# EasyEDA schematic sct.json
TITLE: Sheet_1; REV: 1.0; Date: 2026-02-04; Sheet: 1/1; Drawn By: 20200936pm; Company: Your Company
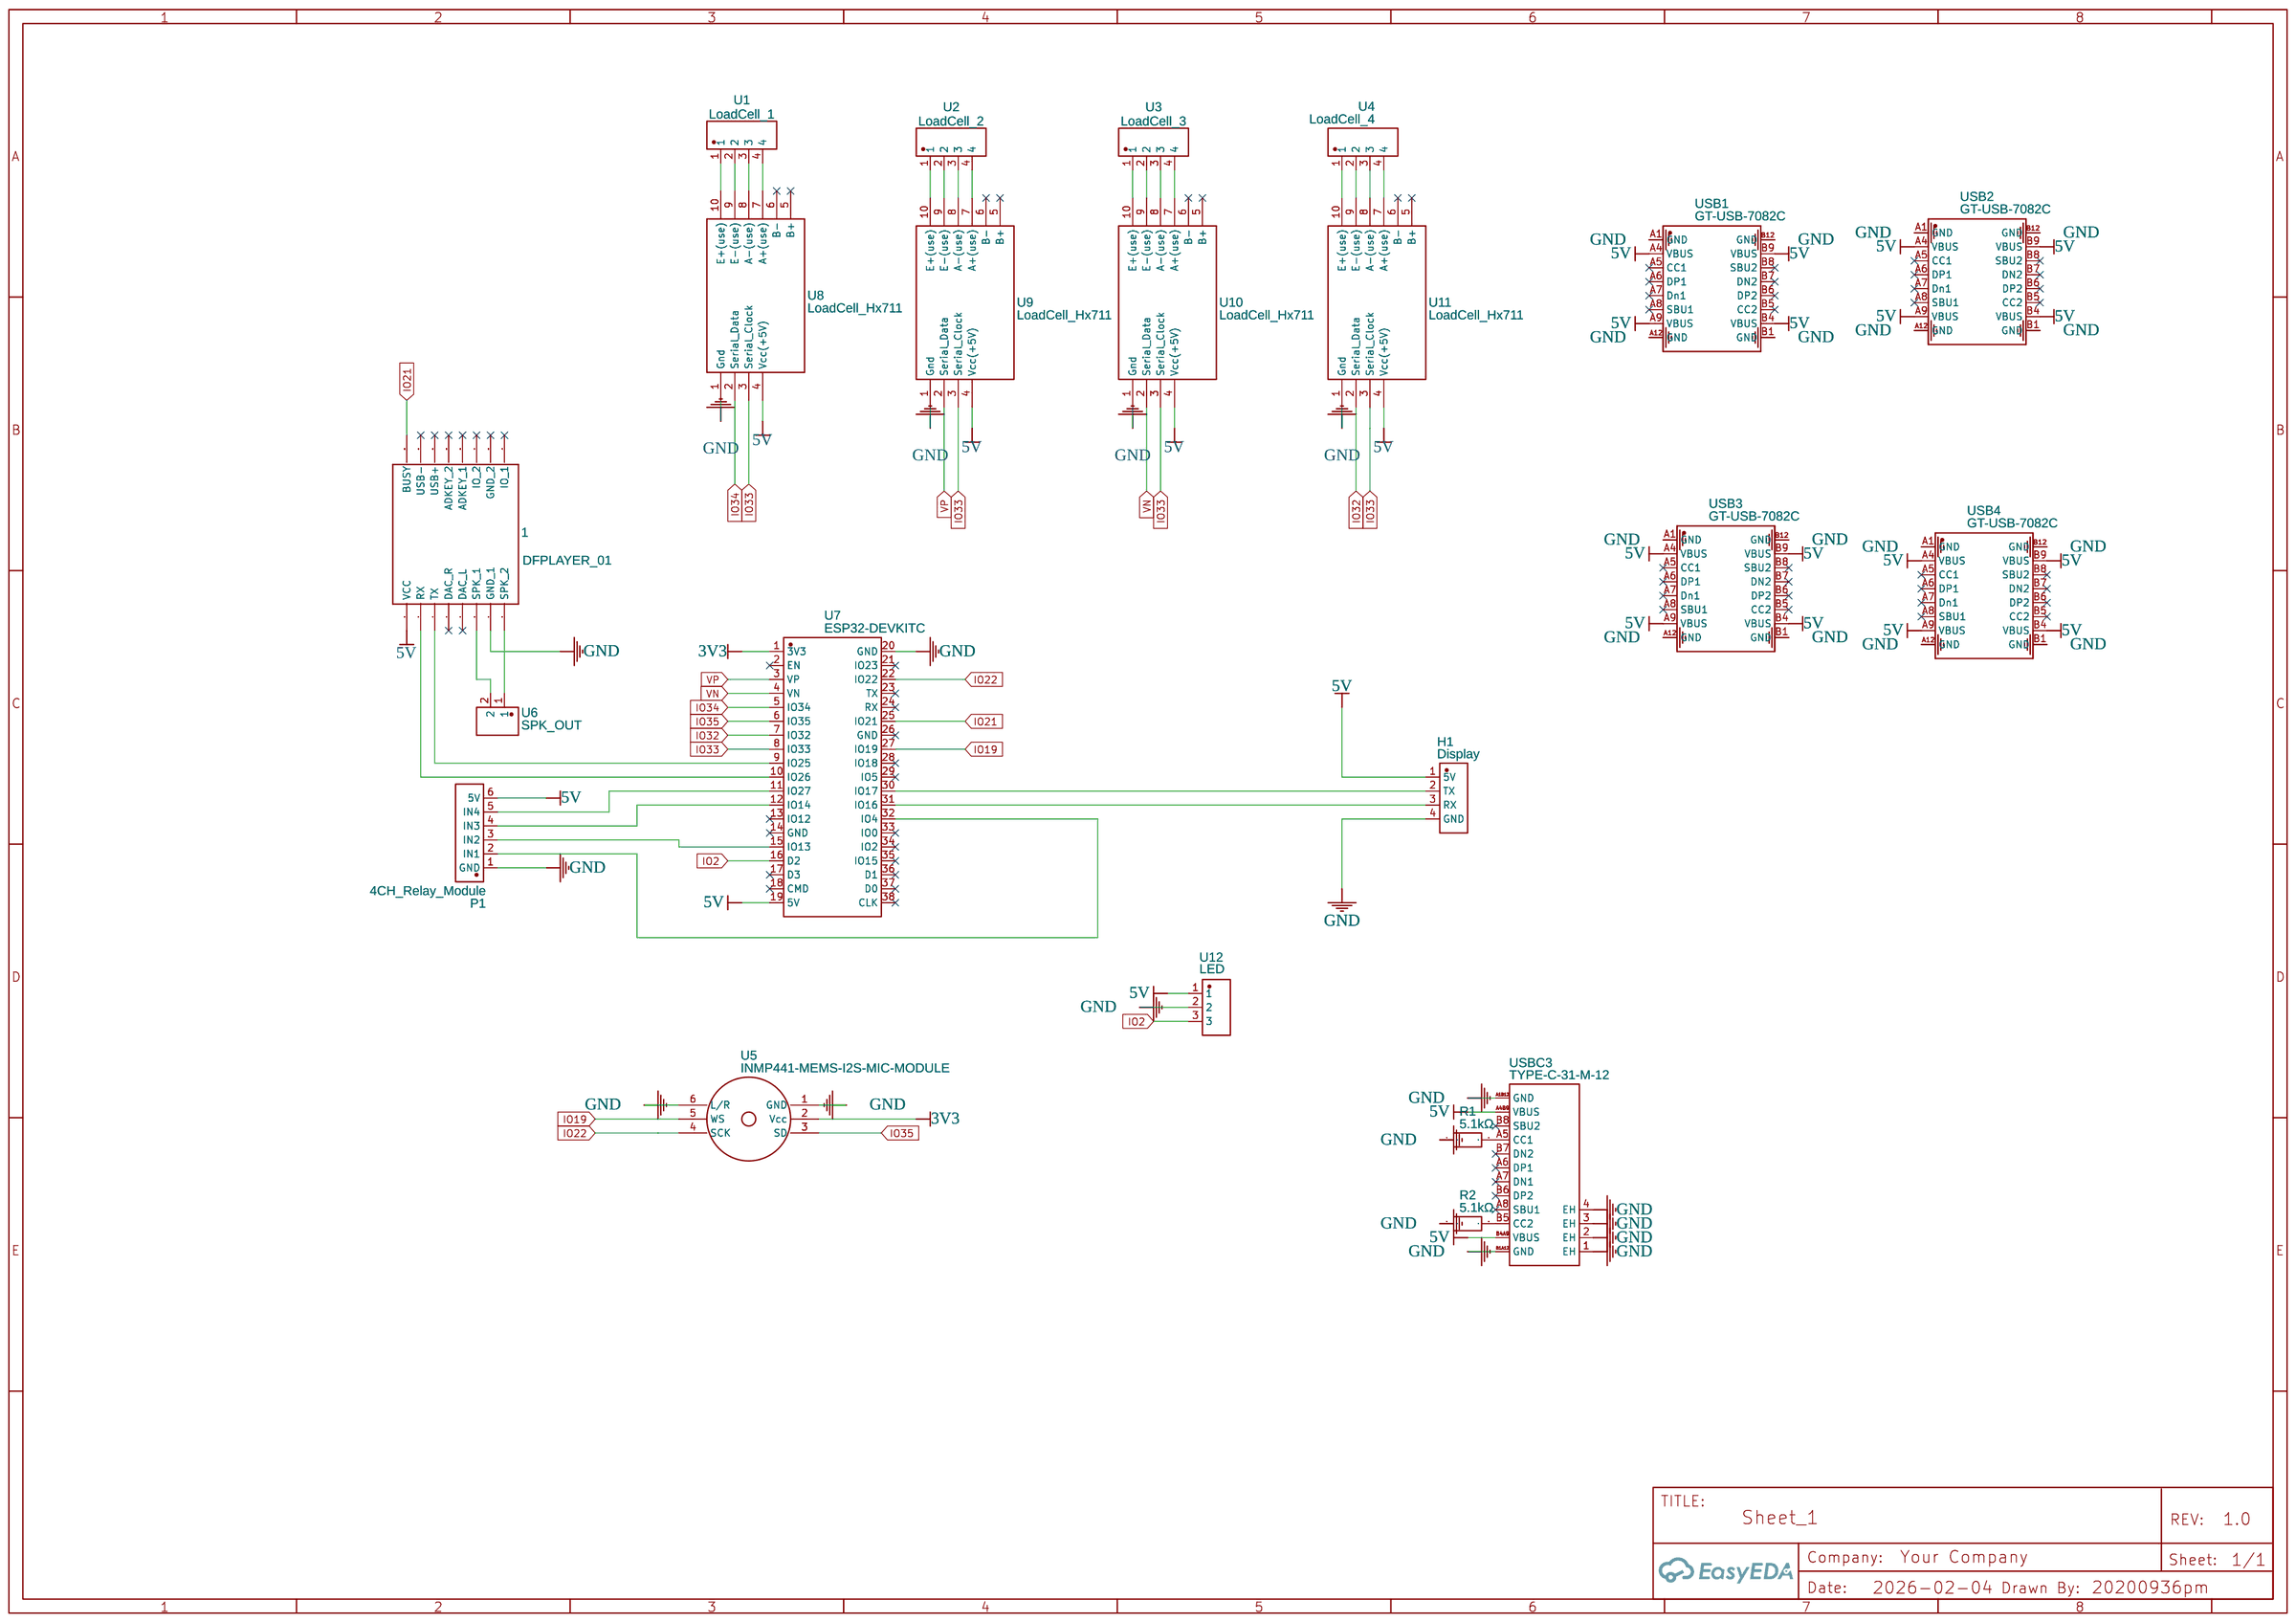
[diagram p0: schematic sheet]

## Parts
1  DFPLAYER_01  [DFPLAYER]
H1  Display  [HDR-TH_4P-P2.54-V-M]
P1  4CH_Relay_Module  [HDR-TH_6P-P2.54-V-F]
R1  5.1kΩ  [R0603]
R2  5.1kΩ  [R0603]
U1  LoadCell_1  [CONN-TH_4P-P2.54_KF128-2.54-4P]
U2  LoadCell_2  [CONN-TH_4P-P2.54_KF128-2.54-4P]
U3  LoadCell_3  [CONN-TH_4P-P2.54_KF128-2.54-4P]
U4  LoadCell_4  [CONN-TH_4P-P2.54_KF128-2.54-4P]
U5  INMP441-MEMS-I2S-MIC-MODULE  [INMP441-MEMS-I2S-MIC-MODULE]
U6  SPK_OUT  [CONN-TH_P5.00_KF301-5.0-2P]
U7  ESP32-DEVKITC  [BULETM-SMD_ESP32-DEVKITC]
U8  LoadCell_Hx711  [LOADCELL_HX711]
U9  LoadCell_Hx711  [LOADCELL_HX711]
U10  LoadCell_Hx711  [LOADCELL_HX711]
U11  LoadCell_Hx711  [LOADCELL_HX711]
U12  LED  [HDR-TH_3P-P2.54-V-F]
USB1  GT-USB-7082C  [USB-C-SMD_GT-USB-7082C]
USB2  GT-USB-7082C  [USB-C-SMD_GT-USB-7082C]
USB3  GT-USB-7082C  [USB-C-SMD_GT-USB-7082C]
USB4  GT-USB-7082C  [USB-C-SMD_GT-USB-7082C]
USBC3  TYPE-C-31-M-12  [USB-C_SMD-TYPE-C-31-M-12_1]

## Library data of the parts
1 = DFPLAYER_01: Contributor: In Floper
H1 = PZ254V-11-04P-A40: Supplier: LCSC; Supplier Part: C42419911; Manufacturer: XFCN(兴飞); Contributor: lcsc
P1 = Header-Female-2.54_1x6: Supplier: LCSC; Manufacturer: BOOMELE(博穆精密); Manufacturer Part: 2.54-1*6P母; Supplier Part: C40877; JLCPCB Part Class: Extended Part
R1 R2 = HOAR0603-1/10W-5.1KR-0.1%-TCR25: Supplier: LCSC; Supplier Part: C5123587; Manufacturer: Milliohm(毫欧); Manufacturer Part: HoAR0603-1/10W-5.1KR-0.1%-TCR25; JLCPCB Part Class: Extended Part; Contributor: lcsc
U1-U4 = KF128-2.54-4P: Contributor: LCSC; Supplier: LCSC; Supplier Part: C474922; Manufacturer: KEFA(科发); JLCPCB Part Class: Extended Part
U5 = INMP441-MEMS-I2S-MIC-MODULE: Supplier: ebay; link: https://www.ebay.de/itm/174127178542; Contributor: hariesh
U6 = KF301-5.0-2P: Contributor: LCSC; Supplier: LCSC; Supplier Part: C474881; Manufacturer: KEFA(科发); JLCPCB Part Class: Extended Part
U7 = ESP32-DEVKITC: Supplier: LCSC; Supplier Part: C571180; Manufacturer: ESPRESSIF(乐鑫); Manufacturer Part: ESP32-DevKitC; Contributor: lcsc
U8-U11 = LoadCell_Hx711: Contributor: suprihandoyo
U12 = DW254R-11-03-85: Contributor: LCSC; Supplier: LCSC; Supplier Part: C2935897; Manufacturer: DEALON(德艺隆); JLCPCB Part Class: Extended Part
USB1-USB4 = GT-USB-7082C: Supplier: LCSC; Supplier Part: C3001291; Manufacturer: G-Switch(品赞); Contributor: lcsc; JLCPCB Part Class: Extended Part
USBC3 = TYPE-C-31-M-12: Contributor: LCSC; Supplier: LCSC; Supplier Part: C165948; Manufacturer: 韩国韩荣; JLCPCB Part Class: Extended Part

## Nets
3V3: U5.2(Vcc) U7.1(3V3)
5V: 1.VCC H1.1(5V) P1.6(5V) U7.19(5V) U8.4(Vcc(+5V)) U9.4(Vcc(+5V)) U10.4(Vcc(+5V)) U11.4(Vcc(+5V)) U12.1 USB1.A4(VBUS) USB1.A9(VBUS) USB1.B4(VBUS) USB1.B9(VBUS) USB2.A4(VBUS) USB2.A9(VBUS) USB2.B4(VBUS) USB2.B9(VBUS) USB3.A4(VBUS) USB3.A9(VBUS) USB3.B4(VBUS) USB3.B9(VBUS) USB4.A4(VBUS) USB4.A9(VBUS) USB4.B4(VBUS) USB4.B9(VBUS) USBC3.A4B9(VBUS) USBC3.B4A9(VBUS)
GND: 1.GND_1 H1.4(GND) P1.1(GND) R1.1 R2.1 U5.1(GND) U5.6(L/R) U7.20(GND) U8.1(Gnd) U9.1(Gnd) U10.1(Gnd) U11.1(Gnd) U12.2 USB1.A1(GND) USB1.A12(GND) USB1.B1(GND) USB1.B12(GND) USB2.A1(GND) USB2.A12(GND) USB2.B1(GND) USB2.B12(GND) USB3.A1(GND) USB3.A12(GND) USB3.B1(GND) USB3.B12(GND) USB4.A1(GND) USB4.A12(GND) USB4.B1(GND) USB4.B12(GND) USBC3.1(EH) USBC3.2(EH) USBC3.3(EH) USBC3.4(EH) USBC3.A1B12(GND) USBC3.B1A12(GND)
IO2: U7.16(D2) U12.3
IO19: U5.5(WS) U7.27(IO19)
IO21: 1.BUSY U7.25(IO21)
IO22: U5.4(SCK) U7.22(IO22)
IO32: U7.7(IO32) U11.2(Serial Data)
IO33: U7.8(IO33) U8.3(Serial Clock) U9.3(Serial Clock) U10.3(Serial Clock) U11.3(Serial Clock)
IO34: U7.5(IO34) U8.2(Serial Data)
IO35: U5.3(SD) U7.6(IO35)
VN: U7.4(VN) U10.2(Serial Data)
VP: U7.3(VP) U9.2(Serial Data)
Net-(1-RX): 1.RX U7.10(IO26)
Net-(1-SPK1): 1.SPK1(SPK_1) U6.2
Net-(1-SPK2): 1.SPK2(SPK_2) U6.1
Net-(1-TX): 1.TX U7.9(IO25)
Net-(H1-2): H1.2(TX) U7.30(IO17)
Net-(H1-3): H1.3(RX) U7.31(IO16)
Net-(P1-2): P1.2(IN1) U7.32(IO4)
Net-(P1-3): P1.3(IN2) U7.15(IO13)
Net-(P1-4): P1.4(IN3) U7.12(IO14)
Net-(P1-5): P1.5(IN4) U7.11(IO27)
Net-(R1-2): R1.2 USBC3.A5(CC1)
Net-(R2-2): R2.2 USBC3.B5(CC2)
Net-(U1-1): U1.1 U8.10(E+(use))
Net-(U1-2): U1.2 U8.9(E-(use))
Net-(U1-3): U1.3 U8.8(A-(use))
Net-(U1-4): U1.4 U8.7(A+(use))
Net-(U2-1): U2.1 U9.10(E+(use))
Net-(U2-2): U2.2 U9.9(E-(use))
Net-(U2-3): U2.3 U9.8(A-(use))
Net-(U2-4): U2.4 U9.7(A+(use))
Net-(U3-1): U3.1 U10.10(E+(use))
Net-(U3-2): U3.2 U10.9(E-(use))
Net-(U3-3): U3.3 U10.8(A-(use))
Net-(U3-4): U3.4 U10.7(A+(use))
Net-(U4-1): U4.1 U11.10(E+(use))
Net-(U4-2): U4.2 U11.9(E-(use))
Net-(U4-3): U4.3 U11.8(A-(use))
Net-(U4-4): U4.4 U11.7(A+(use))

Not connected (* = marked no-connect by the designer): 1 ADKEY1(ADKEY_1)* ADKEY2(ADKEY_2)* DAC_L* DAC_R* GND_2* IO1(IO_1)* IO2(IO_2)* USB+* USB-*; U7 2(EN)* 13(IO12)* 14(GND)* 17(D3)* 18(CMD)* 21(IO23)* 23(TX)* 24(RX)* 26(GND)* 28(IO18)* 29(IO5)* 33(IO0)* 34(IO2)* 35(IO15)* 36(D1)* 37(D0)* 38(CLK)*; U8 5(B+)* 6(B-)*; U9 5(B+)* 6(B-)*; U10 5(B+)* 6(B-)*; U11 5(B+)* 6(B-)*; USB1 A5(CC1)* A6(DP1)* A7(Dn1)* A8(SBU1)* B5(CC2)* B6(DP2)* B7(DN2)* B8(SBU2)*; USB2 A5(CC1)* A6(DP1)* A7(Dn1)* A8(SBU1)* B5(CC2)* B6(DP2)* B7(DN2)* B8(SBU2)*; USB3 A5(CC1)* A6(DP1)* A7(Dn1)* A8(SBU1)* B5(CC2)* B6(DP2)* B7(DN2)* B8(SBU2)*; USB4 A5(CC1)* A6(DP1)* A7(Dn1)* A8(SBU1)* B5(CC2)* B6(DP2)* B7(DN2)* B8(SBU2)*; USBC3 A6(DP1)* A7(DN1)* A8(SBU1)* B6(DP2)* B7(DN2)* B8(SBU2)*
